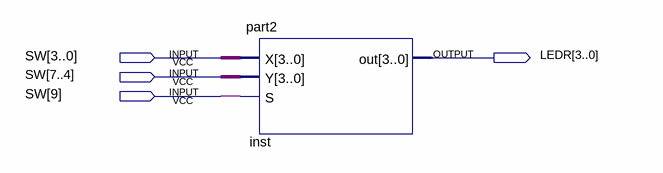
[diagram p0: schematic sheet]
// Quartus schematic part2_sch.bdf as structural Verilog: 1 symbols, 4 pins
module part2_sch (
  input  [9:0] SW,
  output [3:0] LEDR
);

  part2 inst (.X(SW[3:0]), .Y(SW[7:4]), .S(SW[9]), .out(LEDR));
endmodule
